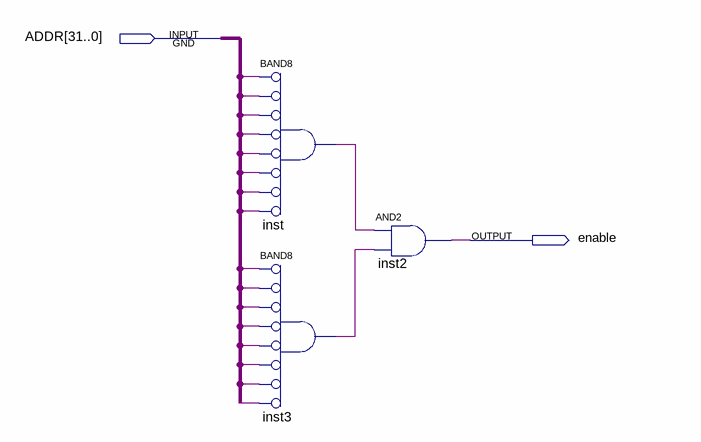
[diagram p0: schematic sheet]
// Quartus schematic per_dc.bdf as structural Verilog: 3 symbols, 2 pins
module per_dc (
  input  [31:0] ADDR,
  output enable
);

  wire inst3_out, inst_out;

  and inst (inst_out, ~ADDR[31], ~ADDR[30], ~ADDR[29], ~ADDR[28], ~ADDR[27], ~ADDR[26], ~ADDR[25], ~ADDR[24]);  // BAND8
  and inst3 (inst3_out, ~ADDR[23], ~ADDR[22], ~ADDR[21], ~ADDR[20], ~ADDR[19], ~ADDR[18], ~ADDR[17], ~ADDR[16]);  // BAND8
  and inst2 (enable, inst_out, inst3_out);
endmodule
